# Altium schematic sheet Single_Matrix.SchDoc
size A4; Author: Jan Rutkowski; CompanyName: AGH; SheetNumber: 3; SheetTotal: 4
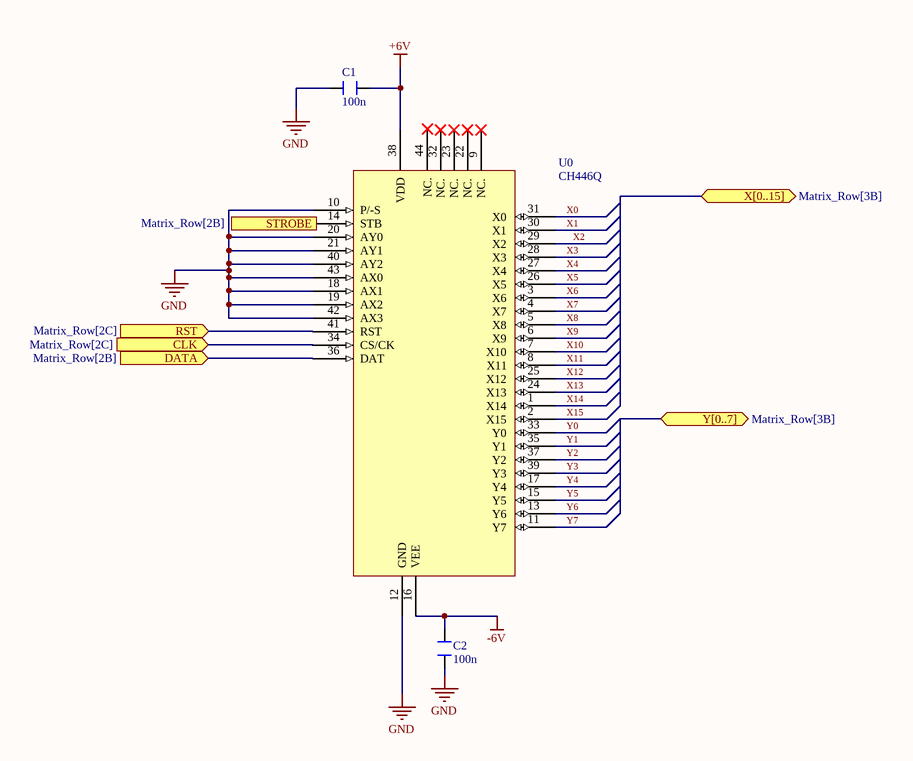
[diagram p0: Single_Matrix.SchDoc]

## Parts
C1  100n  [CL10B104KB8NNNC]
C2  100n  [CL10B104KB8NNNC]
U0  CH446Q  [LQFP-44_CH446Q]

## Ports
CLK (in, see Matrix_Row[2C]), DATA (in, see Matrix_Row[2B]), RST (in, see Matrix_Row[2C]), STROBE (see Matrix_Row[2B]), X[0..15] (bidir, see Matrix_Row[3B]), Y[0..7] (bidir, see Matrix_Row[3B])

## Nets
+6V: C1.8 U0.38(VDD)
-6V: C2.8 U0.16(VEE)
GND: C1.7 C2.7 U0.10(P/-S) U0.12(GND) U0.18(AX1) U0.19(AX2) U0.20(AY0) U0.21(AY1) U0.40(AY2) U0.42(AX3) U0.43(AX0)
CLK: U0.34(CS/CK) ; port CLK
DATA: U0.36(DAT) ; port DATA
RST: U0.41(RST) ; port RST
X0: U0.31(X0)
X1: U0.30(X1)
X2: U0.29(X2)
X3: U0.28(X3)
X4: U0.27(X4)
X5: U0.26(X5)
X6: U0.3(X6)
X7: U0.4(X7)
X8: U0.5(X8)
X9: U0.6(X9)
X10: U0.7(X10)
X11: U0.8(X11)
X12: U0.25(X12)
X13: U0.24(X13)
X14: U0.1(X14)
X15: U0.2(X15)
Y0: U0.33(Y0)
Y1: U0.35(Y1)
Y2: U0.37(Y2)
Y3: U0.39(Y3)
Y4: U0.17(Y4)
Y5: U0.15(Y5)
Y6: U0.13(Y6)
Y7: U0.11(Y7)

Not connected (* = marked no-connect by the designer): U0 9(NC.)* 14(STB) 22(NC.)* 23(NC.)* 32(NC.)* 44(NC.)*

## Notes on the sheet
- Text
- Company Confidential / Not for distribution
- Project name:
- Document Name:
- Free Documents
- Sheet1.SchDoc
- Designer Name:
- Jan Rutkowski
- Date/Time:
- 10.03.26
- Revison:
- 1

## Library data of the parts
C1 C2 = CL10B104KB8NNNC: Capacitor SMD 0603 100n to VDD, VBAT, VDDA, VREF+, VDDUSB, NRST; ComponentLink1Description: New link; ComponentLink1URL: *; Supplier 1: RS; Supplier Part Number 1: 7665443
U0 = CH446Q: Analog Switch Array